# EAGLE design analog (EAGLE 6.4)
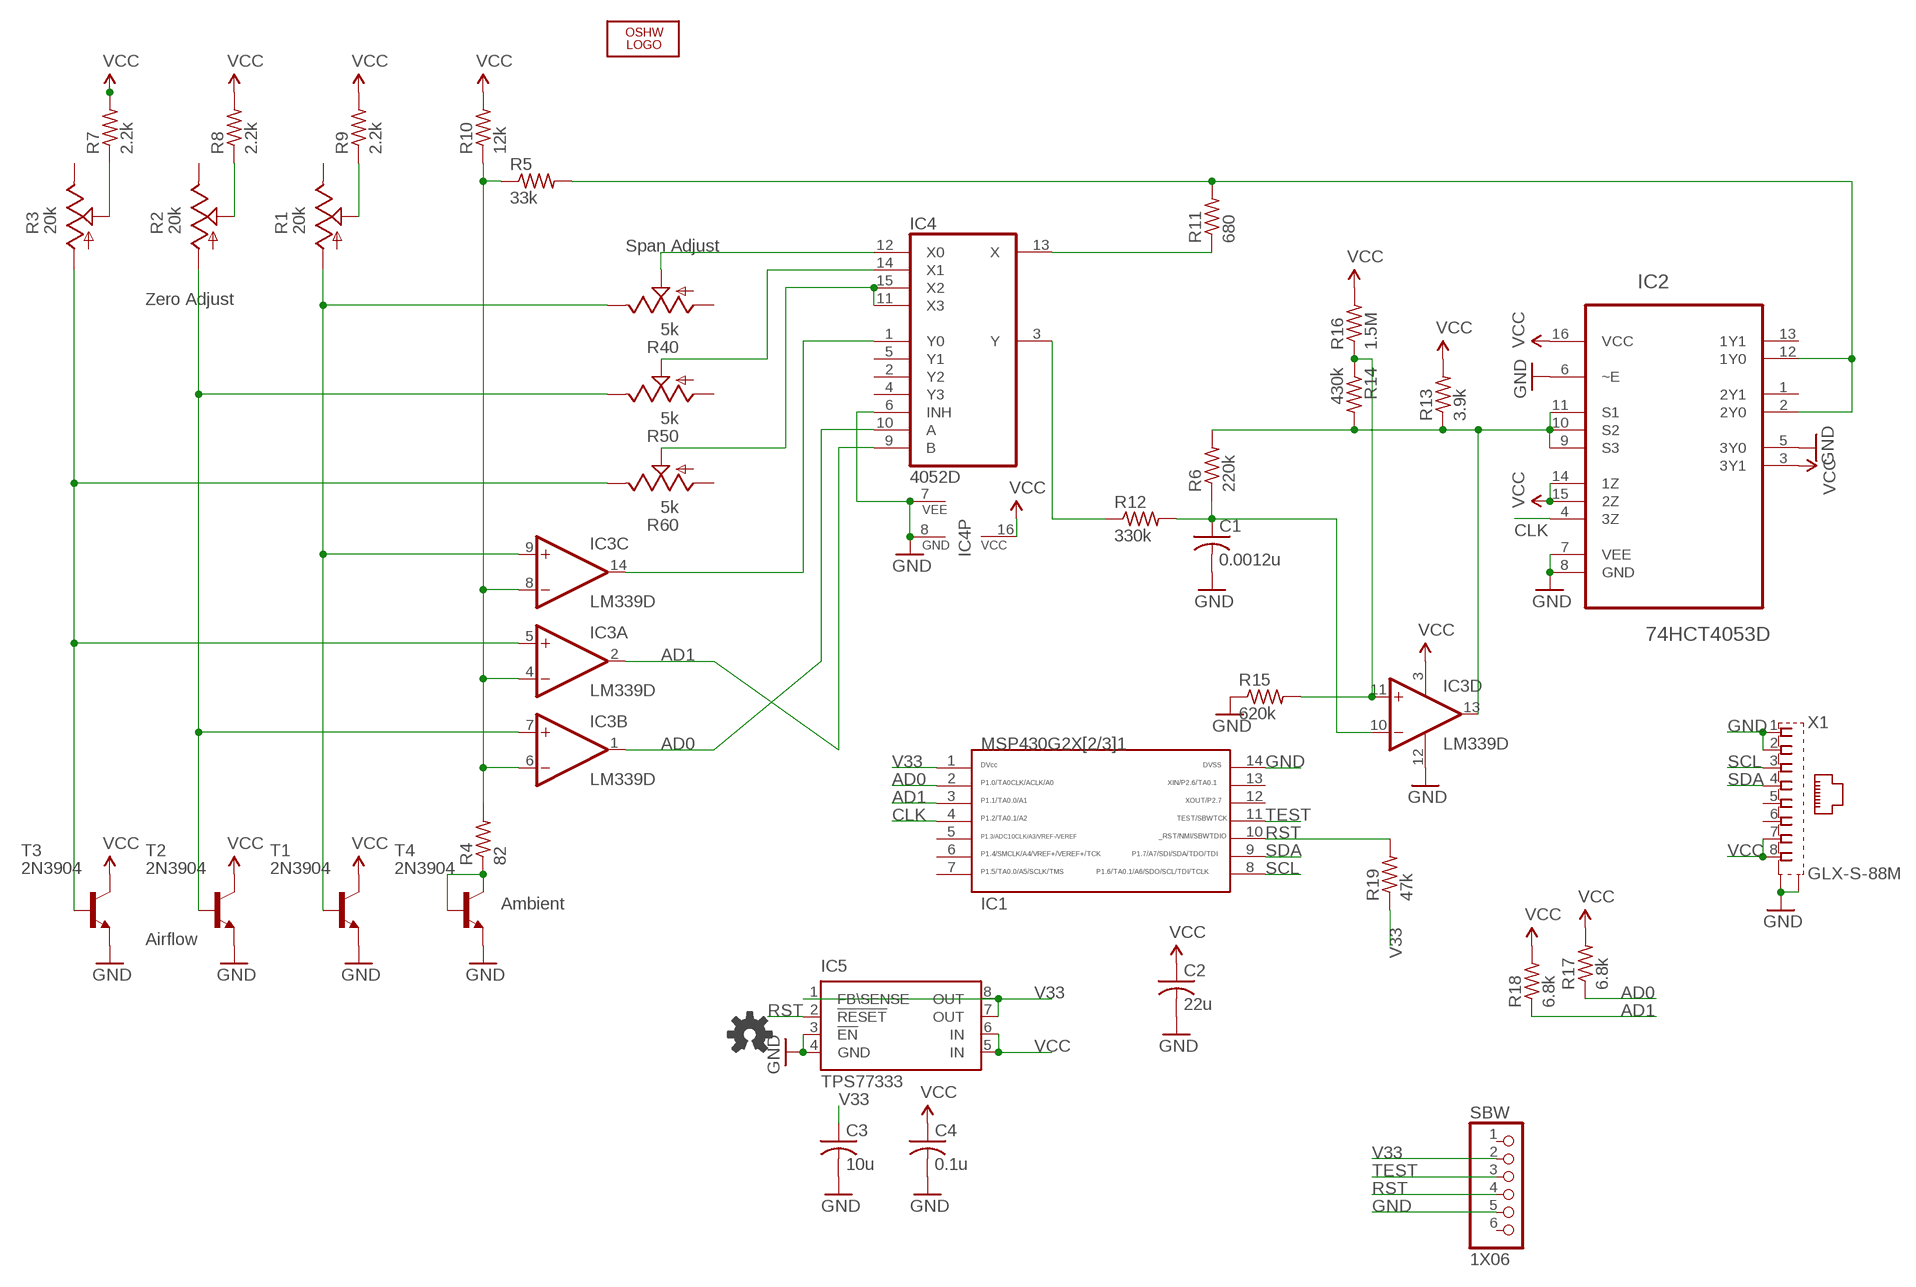
[diagram p0: schematic, sheet 1]

## Parts
C1  0.0012u  C-USC0805  [C0805]
C2  22u  C-USC0805  [C0805]
C3  10u  C-USC0805  [C0805]
C4  0.1u  C-USC0805  [C0805]
IC1  G2X[2/3]1---PW14  [PW14]
IC2  74HCT4053D  [SOIC127P600X175-16N]
IC3  LM339D  [SO14]
IC4  4052D  [SO16]
IC5  TPS77333  [TPS77333]
LOGO1  OSHW_LOGO_FILLX0150-NT  [OSHW_FILLX150_NOTEXT]
R1  20k  TRIM_US-SM-42/43W  [SM-42/43W]
R2  20k  TRIM_US-SM-42/43W  [SM-42/43W]
R3  20k  TRIM_US-SM-42/43W  [SM-42/43W]
R4  82  R-US_M0805  [M0805]
R5  33k  R-US_R0805  [R0805]
R6  220k  R-US_R0805  [R0805]
R7  2.2k  R-US_M0805  [M0805]
R8  2.2k  R-US_R0805  [R0805]
R9  2.2k  R-US_R0805  [R0805]
R10  12k  R-US_R0805  [R0805]
R11  680  R-US_R0805  [R0805]
R12  330k  R-US_R0805  [R0805]
R13  3.9k  R-US_R0805  [R0805]
R14  430k  R-US_R0805  [R0805]
R15  620k  R-US_R0805  [R0805]
R16  1.5M  R-US_R0805  [R0805]
R17  6.8k  R-US_M0805  [M0805]
R18  6.8k  R-US_M0805  [M0805]
R19  47k  R-US_R0805  [R0805]
R40  5k  TRIM_US-SM-42/43W  [SM-42/43W]
R50  5k  TRIM_US-SM-42/43W  [SM-42/43W]
R60  5k  TRIM_US-SM-42/43W  [SM-42/43W]
SBW  1X06  [1X06]
T1  2N3904  [TO92]
T2  2N3904  [TO92]
T3  2N3904  [TO92]
T4  2N3904  [TO92]
X1  GLX-S-88M  [GLX-S-88M]

## Nets
AD0: IC1.2 IC3.1(B:OUT) IC4.10(A) R17.1
AD1: IC1.3 IC3.2(A:OUT) IC4.9(B) R18.1
CLK: IC1.4 IC2.4(3Z)
GND: C1.2 C2.2 C3.2 C4.2 IC1.14 IC2.5(3Y0) IC2.6(~E) IC2.7(VEE) IC2.8(GND) IC3.12(P:GND) IC4.6(INH) IC4.7(VEE) IC4.8(GND) IC5.3(!EN) IC5.4(GND) R15.1 SBW.5 T1.3(E) T2.3(E) T3.3(E) T4.3(E) X1.1 X1.2 X1.S1 X1.S2
N$1: R4.1 T4.1(C) T4.2(B)
N$4: IC3.9(C:+IN) R1.1(A) R40.3(E) T1.2(B)
N$5: IC4.12(X0) R40.2(S)
N$6: IC4.14(X1) R50.2(S)
N$7: IC4.11(X3) IC4.15(X2) R60.2(S)
N$8: R3.2(S) R7.1
N$9: R2.2(S) R8.1
N$10: R1.2(S) R9.1
N$11: IC3.4(A:-IN) IC3.6(B:-IN) IC3.8(C:-IN) R4.2 R5.1 R10.1
N$12: IC3.5(A:+IN) R3.1(A) R60.3(E) T3.2(B)
N$13: IC3.7(B:+IN) R2.1(A) R50.3(E) T2.2(B)
N$14: IC3.14(C:OUT) IC4.1(Y0)
N$15: IC2.2(2Y0) IC2.12(1Y0) R5.2 R11.2
N$16: IC4.13(X) R11.1
N$17: IC4.3(Y) R12.1
N$18: C1.1 IC3.10(D:-IN) R6.1 R12.2
N$19: IC2.9(S3) IC2.10(S2) IC2.11(S1) IC3.13(D:OUT) R6.2 R13.1 R14.2
N$21: IC3.11(D:+IN) R14.1 R15.2 R16.1
RST: IC1.10 IC5.2(!RESET) R19.2 SBW.4
SCL: IC1.8 X1.3
SDA: IC1.9 X1.4
TEST: IC1.11 SBW.3
V33: C3.1 IC1.1 IC5.1(FB\SENSE) IC5.7(OUT) IC5.8(OUT) R19.1 SBW.2
VCC: C2.1 C4.1 IC2.3(3Y1) IC2.14(1Z) IC2.15(2Z) IC2.16(VCC) IC3.3(P:V+) IC4.16(VCC) IC5.5(IN) IC5.6(IN) R7.2 R8.2 R9.2 R10.2 R13.2 R16.2 R17.2 R18.2 T1.1(C) T2.1(C) T3.1(C) X1.7 X1.8
Unconnected: IC1.5 IC1.6 IC1.7 IC1.12 IC1.13 IC2.1(2Y1) IC2.13(1Y1) IC4.2(Y2) IC4.4(Y3) IC4.5(Y1) R1.3(E) R2.3(E) R3.3(E) R40.1(A) R50.1(A) R60.1(A) SBW.1 SBW.6 X1.5 X1.6

## Notes on the sheet
- Span Adjust
- Zero Adjust
- Ambient
- Airflow

## Library data of the parts
C1-C4 = rcl:C-US: CAPACITOR, American symbol
IC1 = TI_MSP430_v16:G2X[2/3]1---PW14: MSP430G2X[2/3]1 TSSOP (PW) 14 Pin Package http://focus.ti.com/docs/prod/folders/print/msp430g2221.html MSP430G2121, MSP430G2221, MSP430G2131
IC2 = custom:74HCT4053D: Triple 2-channel analog multiplexer/demultiplexer; MPN: 74HCT4053D; OC_FARNELL: 1085325; OC_NEWARK: 99K0560; PACKAGE: SOIC-16; SUPPLIER: NXP
IC3 = linear:LM339: Low Power Low Offset Voltage Quad Comparators with open collector; LM139/LM239/LM339/LM2901/LM3302
IC4 = 40xx:4052: Dual 4-channel ANALOG MULTIPLEXER
IC5 = custom:TPS77333
LOGO1 = ohw-logo:OSHW_LOGO_FILL
R1-R3 R40 R50 R60 = pot:TRIM_US-: POTENTIOMETER
R4-R6 R8-R19 = rcl:R-US_: RESISTOR, American symbol
R7 = resistor:R-US_: RESISTOR, American symbol
SBW = pinhead_1.27mm:1X06
T1-T4 = transistor:2N3904: NPN TRANSISTOR
X1 = con-kycon:GLX-S-88M: Mod. Jack, Right Angle, 8 posiotion, 8 contatcs RJ45 Source: GLX-S-88M.pdf; OC_FARNELL: unknown; OC_NEWARK: unknown

## Net classes
1 Ground: width 0.1 mm, drill 0.2 mm

## Board
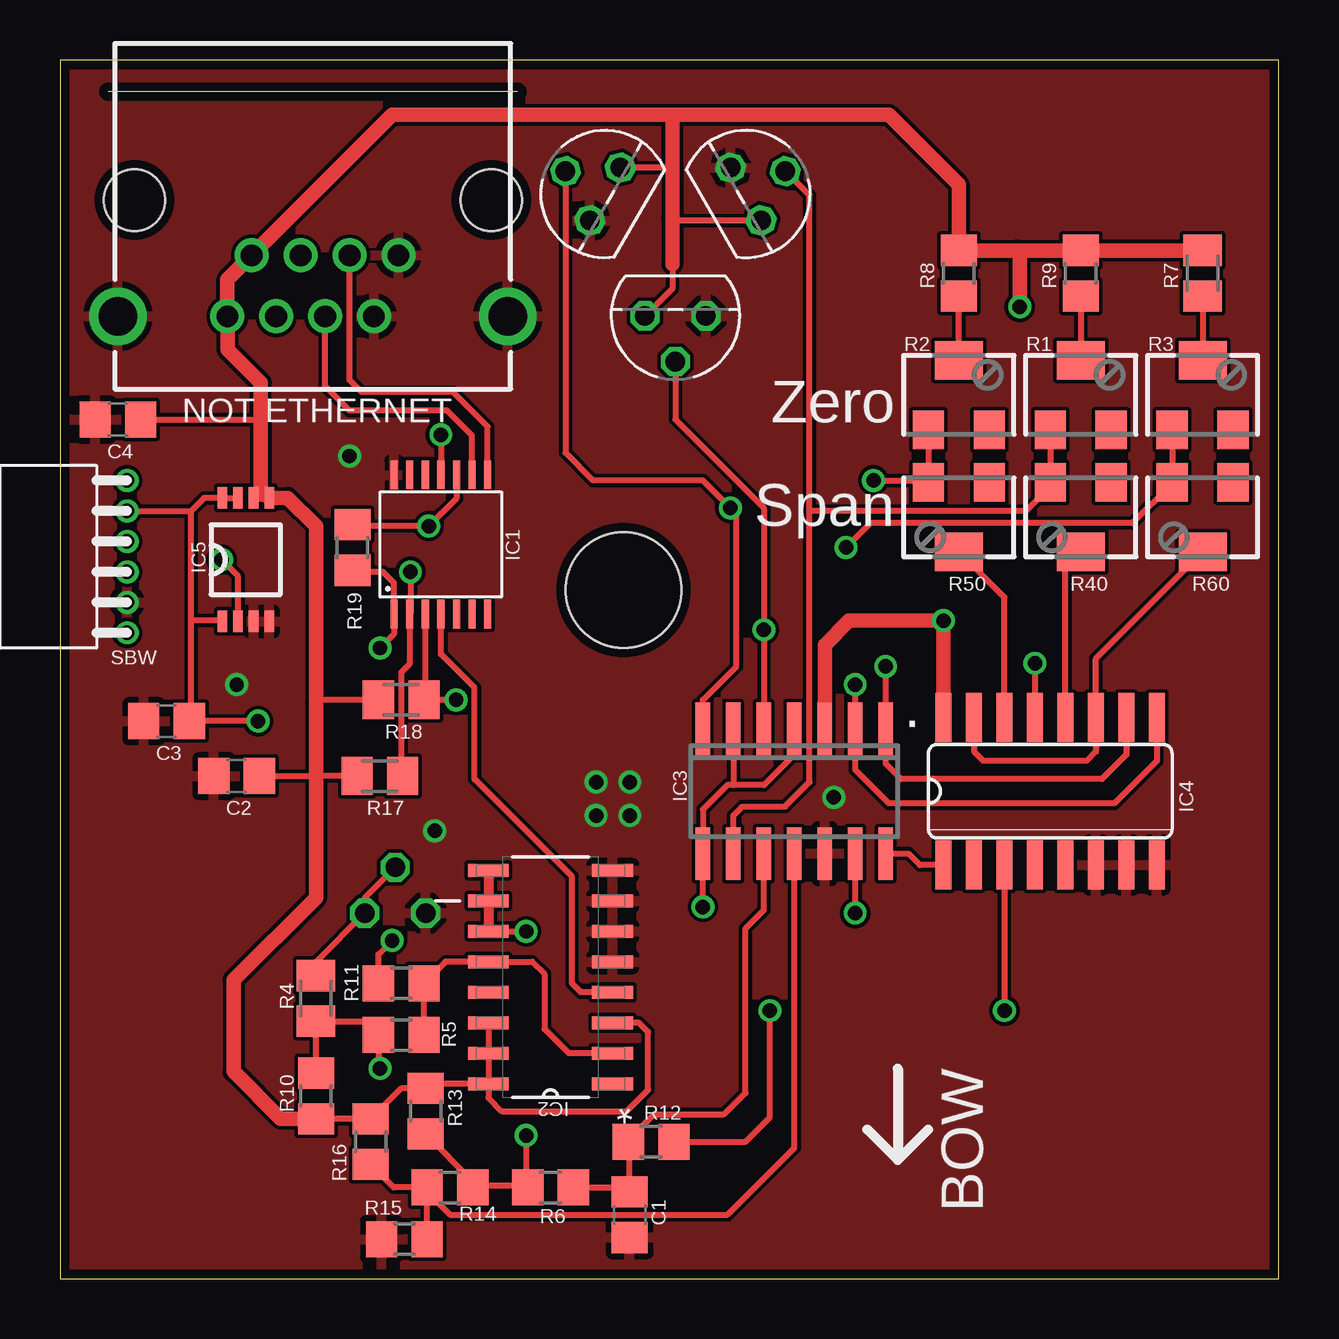
[diagram p1: board, top side]
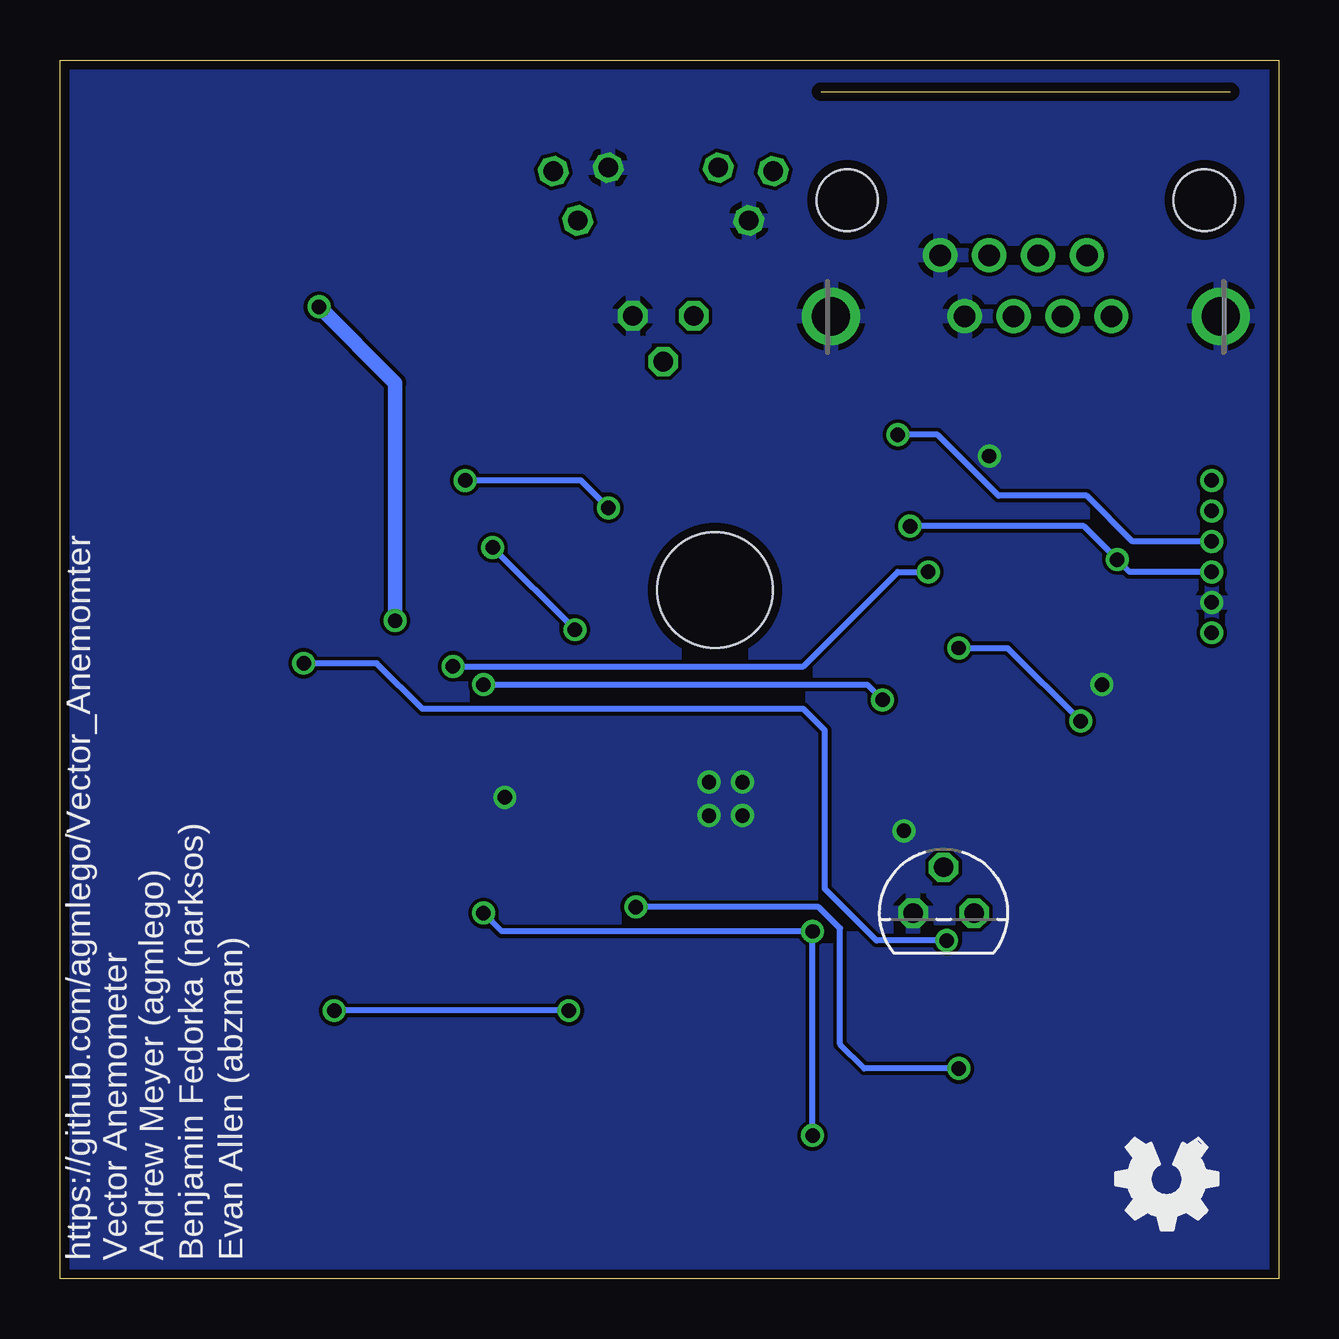
[diagram p2: board, bottom side, seen from below]

Size 50.8 x 50.8 mm. Coordinates in mm from the lower left corner, seen from the top.
Outline: 0,0 50.8,0 50.8,50.8 0,50.8 0,0
Copper layers (1*16): Top 0.0356mm / dielectric 1.5011mm / Bottom 0.0356mm
Design rules "LaenPCBOrder": minimum track width 6mil, minimum drill 13mil, track to track 6mil, track to pad 6mil, pad to pad 6mil, via to via 6mil, smd to smd 6mil, copper to edge 15mil, drill to drill 6mil, minimum pad ring 7mil, minimum via ring 7mil, stop-mask expansion 4mil, vias tented up to drill 0mil, thermal gap 10mil
Holes 4.83 mm at 23.5,28.7

### Footprints (pad centres in the part's own frame; a part is rotated, then mirrored left to right if it is on the bottom)
C0805 = smd 1.3 x 1.5: 1 -0.95,0; 2 0.95,0
PW14 = smd 0.3 x 1.2: 1 -1.95,-2.9; 2 -1.3,-2.9; 3 -0.65,-2.9; 4 0,-2.9; 5 0.65,-2.9; 6 1.3,-2.9; 7 1.95,-2.9; 8 1.95,2.9; 9 1.3,2.9; 10 0.65,2.9; 11 0,2.9; 12 -0.65,2.9; 13 -1.3,2.9; 14 -1.95,2.9
SOIC127P600X175-16N = smd 1.702 x 0.533: 1 -2.591,4.445; 2 -2.591,3.175; 3 -2.591,1.905; 4 -2.591,0.635; 5 -2.591,-0.635; 6 -2.591,-1.905; 7 -2.591,-3.175; 8 -2.591,-4.445; 9 2.591,-4.445; 10 2.591,-3.175; 11 2.591,-1.905; 12 2.591,-0.635; 13 2.591,0.635; 14 2.591,1.905; 15 2.591,3.175; 16 2.591,4.445
SO14 = smd 0.6 x 2.2: 1 -3.81,-2.6; 2 -2.54,-2.6; 3 -1.27,-2.6; 4 0,-2.6; 5 1.27,-2.6; 6 2.54,-2.6; 7 3.81,-2.6; 8 3.81,2.6; 9 2.54,2.6; 10 1.27,2.6; 11 0,2.6; 12 -1.27,2.6; 13 -2.54,2.6; 14 -3.81,2.6
SO16 = smd 0.66 x 2.032: 1 -4.445,-3.073; 2 -3.175,-3.073; 3 -1.905,-3.073; 4 -0.635,-3.073; 5 0.635,-3.073; 6 1.905,-3.073; 7 3.175,-3.073; 8 4.445,-3.073; 9 4.445,3.073; 10 3.175,3.073; 11 1.905,3.073; 12 0.635,3.073; 13 -0.635,3.073; 14 -1.905,3.073; 15 -3.175,3.073; 16 -4.445,3.073
TPS77333 = smd 0.9 x 0.4: 1 -2.575,0.975; 2 -2.575,0.325; 3 -2.575,-0.325; 4 -2.575,-0.975; 5 2.575,-0.975; 6 2.575,-0.325; 7 2.575,0.325; 8 2.575,0.975
SM-42/43W = smd 1.3 x 1.6: 1 -1.27,-1.45; 3 1.27,-1.45 | smd 2 x 1.6: 2 0,1.45
M0805 = smd 1.3 x 1.6: 1 -0.95,0; 2 0.95,0
R0805 = smd 1.3 x 1.5: 1 -0.95,0; 2 0.95,0
1X06 = drill 0.6: 1 -3.175,0; 2 -1.905,0; 3 -0.635,0; 4 0.635,0; 5 1.905,0; 6 3.175,0
TO92 = drill 0.813 octagon: 1 1.27,0; 2 0,1.905; 3 -1.27,0
GLX-S-88M = drill 0.9 pad 1.422: 1 -3.57,-2.3; 2 -2.55,-4.84; 3 -1.53,-2.3; 4 -0.51,-4.84; 5 0.51,-2.3; 6 1.53,-4.84; 7 2.55,-2.3; 8 3.57,-4.84 | drill 1.6 pad 2.184: S1 -8.125,-4.84; S2 8.125,-4.84 | hole 2.55: -7.44,0; 7.44,0

### Placement (x,y rotation side)
C1  23.75,2.67 270 top
C2  7.37,20.95 180 top
C3  4.45,23.24 180 top
C4  2.41,35.81 180 top
IC1  15.88,30.61 0 top
IC2  20.45,12.57 180 top
IC3  30.61,20.32 180 top
IC4  41.27,20.32 0 top
IC5  7.75,29.97 90 top
LOGO1  2.54,5.84 180 bottom
R1  42.55,36.83 0 top
R2  37.47,36.83 0 top
R3  47.62,36.83 0 top
R4  10.67,11.68 270 top
R5  14.22,10.16 0 top
R6  20.45,3.81 180 top
R7  47.62,41.91 90 top
R8  37.47,41.91 90 top
R9  42.55,41.91 90 top
R10  10.67,7.62 270 top
R11  14.22,12.32 0 top
R12  24.64,5.71 180 top
R13  15.24,6.99 90 top
R14  16.26,3.81 0 top
R15  14.35,1.65 0 top
R16  12.95,5.71 90 top
R17  13.34,20.95 180 top
R18  14.22,24.13 180 top
R19  12.19,30.48 90 top
R40  42.55,31.75 180 top
R50  37.47,31.75 180 top
R60  47.62,31.75 180 top
SBW  2.79,30.1 270 top
T1  28.59,45.21 300 top
T2  22.72,45.21 60 top
T3  25.65,40.13 180 top
T4  13.97,15.24 0 bottom
X1  10.54,44.96 0 bottom

### Tracks (layer width: path | path; a pad name or v marks a point on that pad's centre or on a via)
AD0  (via drill 0.6)
  Top 0.254: IC4.10 44.45,21.84 43.43,20.83 35.05,20.83 34.42,21.46 IC3.1 v34.42,25.53 | R17.1 14.22,21.02 14.22,25.27 14.57,25.62 IC1.2 14.61,27.74 v14.61,29.46
  Bottom 0.254: v34.42,25.53 19.81,25.53 15.88,29.46 v14.61,29.46
AD1  (via drill 0.6)
  Top 0.254: IC4.9 45.72,21.59 43.94,19.81 34.54,19.81 33.15,21.21 IC3.2 v33.15,24.77 | IC1.3 15.22,24.18 R18.1 v16.51,24.13
  Bottom 0.254: v33.15,24.77 17.14,24.77 v16.51,24.13
CLK
  Top 0.254: IC2.4 21.72,11.94 21.34,12.32 21.34,16.76 17.27,20.83 17.27,24.64 15.88,26.04 IC1.4
GND  (via drill 0.6)
  other vias: 12.06,34.29 7.37,24.77 32.26,20.07 15.62,18.67 22.35,19.3 22.35,20.7 23.75,20.7 23.75,19.3
  pour Top: 0,0 50.8,0 50.8,50.8 0,50.8
  pour Bottom: 50.8,50.8 50.8,0 0,0 0,50.8
N$1
  Top 0.254: T4.2 12.7,15.88 T4.1 10.67,13.21 R4.1
N$4
  Top 0.254: R1.1 R40.3 41.27,33.02 40.26,32 31.24,32 | IC3.9 28.07,19.3 28.45,19.68 30.23,19.68 31.24,20.7 31.24,32 | 31.24,32 31.24,45.16 T1.2
N$5
  Top 0.254: IC4.12 41.91,29.66 R40.2
N$6
  Top 0.254: IC4.14 39.37,28.39 R50.2
N$7
  Top 0.254: R60.2 43.18,25.86 IC4.11 43.18,21.97 42.8,21.59 38.48,21.59 38.1,21.97 IC4.15
N$8
  Top 0.254: R7.1 R3.2
N$9
  Top 0.254: R2.2 R8.1
N$10
  Top 0.254: R9.1 R1.2
N$11  (via drill 0.6)
  Top 0.254: IC3.4 30.61,21.84 29.34,20.57 28.07,20.57 | 28.07,20.57 27.81,20.57 26.8,19.56 IC3.8 v26.8,15.49 | IC3.6 28.07,20.57 | R10.1 R4.2 12.7,10.73 R5.1 13.27,8.82 v13.34,8.76
  Bottom 0.254: v13.34,8.76 17.27,8.76 18.29,9.78 18.29,14.61 19.18,15.49 v26.8,15.49
N$12  (via drill 0.6)
  Top 0.254: R3.1 R60.3 46.35,33.15 44.7,31.5 33.78,31.5 v32.77,30.48 | IC3.5 v29.34,27.05 29.34,32.13 25.65,35.81 T3.2
  Bottom 0.254: v32.77,30.48 v29.34,27.05
N$13  (via drill 0.6)
  Top 0.254: R2.1 R50.3 36.12,33.27 v33.91,33.27 | T2.2 21.07,34.43 22.23,33.27 26.8,33.27 v27.94,32.13 28.19,31.88 28.19,25.53 26.8,24.13 IC3.7
  Bottom 0.254: v33.91,33.27 29.08,33.27 v27.94,32.13
N$14
  Top 0.254: IC3.14 35.37,17.72 35.84,17.25 IC4.1
N$15
  Top 0.254: IC2.2 21.21,9.4 20.19,10.41 20.19,12.7 19.68,13.21 IC2.12 16.06,13.21 R11.2 R5.2
N$16  (via drill 0.6)
  Top 0.254: R11.1 13.27,13.53 v13.84,14.1 | v40.64,25.65 IC4.13
  Bottom 0.254: v13.84,14.1 16.76,14.1 18.92,16.26 18.92,22.86 19.81,23.75 35.69,23.75 37.59,25.65 v40.64,25.65
N$17  (via drill 0.6)
  Top 0.254: IC4.3 v39.37,11.18 | R12.1 28.57,5.71 29.59,6.73 v29.59,11.18
  Bottom 0.254: v29.59,11.18 v39.37,11.18
N$18
  Top 0.254: R6.1 23.68,3.81 C1.1 23.75,5.65 R12.2 23.69,5.78 24.77,6.86 27.69,6.86 28.57,7.75 28.57,14.61 29.34,15.37 IC3.10
N$19  (via drill 0.6)
  Top 0.254: IC2.11 v19.43,14.48 | v19.43,5.97 19.43,3.88 | 19.43,3.88 R6.2 | 19.43,3.88 17.27,3.88 R14.2 17.21,4.07 R13.1 | v33.15,15.24 IC3.13
  Top 0.406: IC2.9 IC2.10 IC2.11
  Bottom 0.254: v19.43,5.97 v19.43,14.48 32.38,14.48 v33.15,15.24
N$21
  Top 0.254: R15.2 R14.1 | R14.1 13.91,3.81 R16.1 | R14.1 15.31,3.62 16.26,2.67 27.81,2.67 30.61,5.46 IC3.11
RST  (via drill 0.6)
  Top 0.254: IC1.10 16.52,32.53 v15.37,31.37 12.25,31.37 R19.2 | IC5.2 7.42,29.28 v6.73,29.97
  Bottom 0.254: v15.37,31.37 8.13,31.37 v6.73,29.97 6.22,29.46 SBW.4
SCL
  Top 0.254: IC1.8 17.82,35.52 16.38,36.96 12.57,36.96 12.06,37.47 X1.3
SDA
  Top 0.254: IC1.9 17.18,35.15 16.13,36.2 12.06,36.2 11.05,37.21 X1.4
TEST  (via drill 0.6)
  Top 0.254: v15.88,35.18 IC1.11
  Bottom 0.254: SBW.3 6.1,30.73 8,32.64 11.68,32.64 14.22,35.18 v15.88,35.18
V33  (via drill 0.6)
  Top 0.254: v13.34,26.29 13.93,26.88 IC1.1 13.93,29 13.46,29.46 12.26,29.46 R19.1 | v8.26,23.24 C3.1 5.46,23.31 5.46,27.43 | SBW.2 5.46,32 | 5.46,32 6,32.55 IC5.8 IC5.7 | 5.46,27.43 5.46,32 | IC5.1 6.73,27.43 5.46,27.43
  Bottom 0.254: v13.34,26.29 11.3,26.29 v8.26,23.24
VCC  (via drill 0.6)
  Top 0.254: IC2.16 IC2.15 IC2.14 IC2.16 | IC2.16 17.86,7.54 18.41,6.99 23.62,6.99 24.51,7.87 24.51,10.29 24.13,10.67 IC2.3 22.99,10.67 | 31.88,22.99 IC3.3 | R18.2 10.79,24.13 10.67,24 | R17.2 10.79,20.95 10.67,20.83 10.54,20.95 C2.1 | C4.1 8.24,35.81 8.37,35.69 | IC2.16 15.43,8.13 R13.2 14.22,7.93 R16.2 R10.2 | 25.53,46.35 25.48,46.31 T2.1 | T1.1 25.61,44.11 25.53,44.2 | 25.53,42.29 25.53,41.27 T3.1
  Top 0.305: IC5.6 IC5.5
  Top 0.61: 39.88,42.86 R8.2 37.47,45.59 34.54,48.51 25.53,48.51 | 39.88,42.86 R9.2 R7.2 | IC3.3 31.88,26.42 32.89,27.43 v36.83,27.43 IC4.16 | v40.01,40.51 40.01,42.73 39.88,42.86 | R10.2 9.21,6.67 7.24,8.64 7.24,12.45 10.67,15.88 10.67,20.83 10.67,24 10.67,31.37 9.49,32.55 IC5.5 8.37,32.9 8.37,35.69 8.37,37.35 6.99,38.73 6.99,40.1 X1.8 6.97,41.64 X1.7 13.84,48.51 25.53,48.51 | 25.53,48.51 25.53,46.35 25.53,44.2 25.53,42.29
  Bottom 0.61: v36.83,27.43 36.83,37.34 v40.01,40.51

### Text on the board
tPlace: Zero | Span | BOW
_tsilk: NOT ETHERNET | .
_bsilk: Evan Allen (abzman) | Benjamin Fedorka (narksos) | Andrew Meyer (agmlego) | Vector Anemometer | https://github.com/agmlego/Vector_Anemomter